# Altium schematic sheet Fan_Control.SchDoc: Fan Control
size A4; Revision: 1.0; SheetNumber: 10; SheetTotal: 11; Class: B
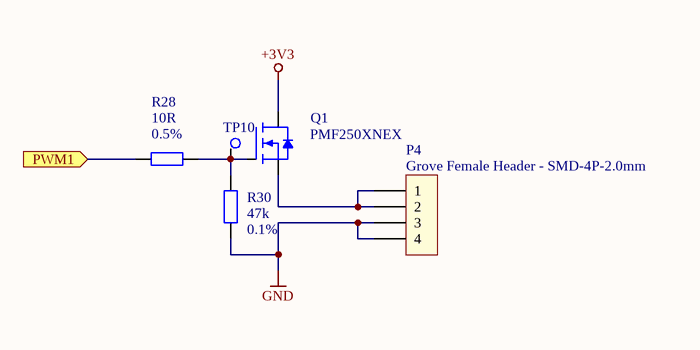
[diagram p0: Fan_Control.SchDoc]

## Parts
P4  P_Header_4  [CONN_114020164]  (value not drawn)
Q1  value PMF250XNEX  [SOT323]  (hidden comment: Q_NMOSFET)
R28  value 10R  Tolerance: 0.5%  [R_0603]  (hidden comment: R)
R30  value 47k  Tolerance: 0.1%  [R_0402]  (hidden comment: R)
TP10  TP_TestPoint  [TP_01]  (value not drawn)

## Ports
PWM1 (in)

## Nets
+3V3: Q1.3(D)
GND: P4.3 P4.4 R30.2
PWM1: R28.1 ; port PWM1
NetP4_1: P4.1 P4.2 Q1.2(S)
NetQ1_1: Q1.1(G) R28.2 R30.1 TP10.1

## Notes on the sheet
- Title:
- Date:
- Revision:
- Class:
- Sheet
- of

## Library data of the parts
P4 = 114020164: Grove Female Header - SMD-4P-2.0mm; Manufacturer: SEEED; Grade: 3; Value: 114020164; Desc: Grove Female Header - SMD-4P-2.0mm; Part Number: 114020164; HelpURL: https://files.seeedstudio.com/products/114020164/res/Grove%20Female%20Header%20-%20SMD-4P-2.0mm-90D%20Datasheet.pdf; Manufacturer Part Number: 114020164; Supplier 1: Mouser; Supplier Part Number 1: 713-114020164; Status: Active
Q1 = PMF250XNEX: 30V 1A Single N-Channel; Manufacturer: NEXPERIA; Max Power Dissipation: 0.342w; Tmax: 150; Tmin: -55; Grade: 2; Part Number: PMF250XNEX; HelpURL: https://assets.nexperia.com/documents/data-sheet/PMF250XNE.pdf; Manufacturer Part Number: PMF250XNEX; Supplier 1: Mouser; Supplier Part Number 1: 771-PMF250XNEX; Status: Active
R28 = R_10R_75V_0603: Manufacturer: Vishay; Manufacturer Part Number: MCT0603PD1009DP500; Voltage: 75V; RMS Power: 0.25W; TCR: 25ppm; Tmax: 175; Tmin: -55; Grade: 2; Part Number: R_10R_75V_0603; HelpURL: https://www.vishay.com/docs/28916/mcxhp.pdf; Supplier 2: Mouser; Supplier Part Number 2: 594-MCT0603PD1009DP5; Supplier 1: Digi-Key; Supplier Part Number 1: 749-1520-1-ND; Status: Active
R30 = R_47k_50V_0402: Manufacturer: Vishay; Manufacturer Part Number: MCS0402MD4702BE100; Voltage: 50V; RMS Power: 0.1W; TCR: 25ppm; Tmax: 155; Tmin: -55; Grade: 2; Part Number: R_47k_50V_0402; HelpURL: https://www.vishay.com/docs/28785/mcat_pre.pdf; Supplier 2: Mouser; Supplier Part Number 2: 594-MCS0402MD4702BE1; Supplier 1: Digi-Key; Supplier Part Number 1: MCS0402-47.0K-MBCT-ND; Status: Active
TP10 = TestPoint1: Manufacturer: Progresja Space; Value: TP; Grade: 3; Part Number: TestPoint1; Status: Active